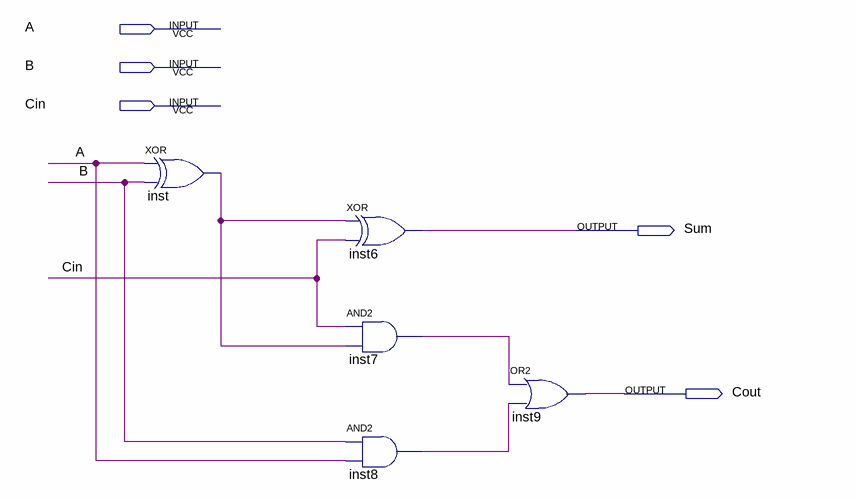
[diagram p0: schematic sheet]
// Quartus schematic g27_adder.bdf as structural Verilog: 5 symbols, 5 pins
module g27_adder (
  input  A,
  input  B,
  input  Cin,
  output Sum,
  output Cout
);

  wire inst7_out, inst8_out, inst_out;

  xor inst (inst_out, A, B);
  xor inst6 (Sum, inst_out, Cin);
  and inst7 (inst7_out, Cin, inst_out);
  and inst8 (inst8_out, B, A);
  or inst9 (Cout, inst7_out, inst8_out);
endmodule
